# EAGLE design ethernet-wing-v1.00 (EAGLE 9.1.0)

## Sheet 1 of 2
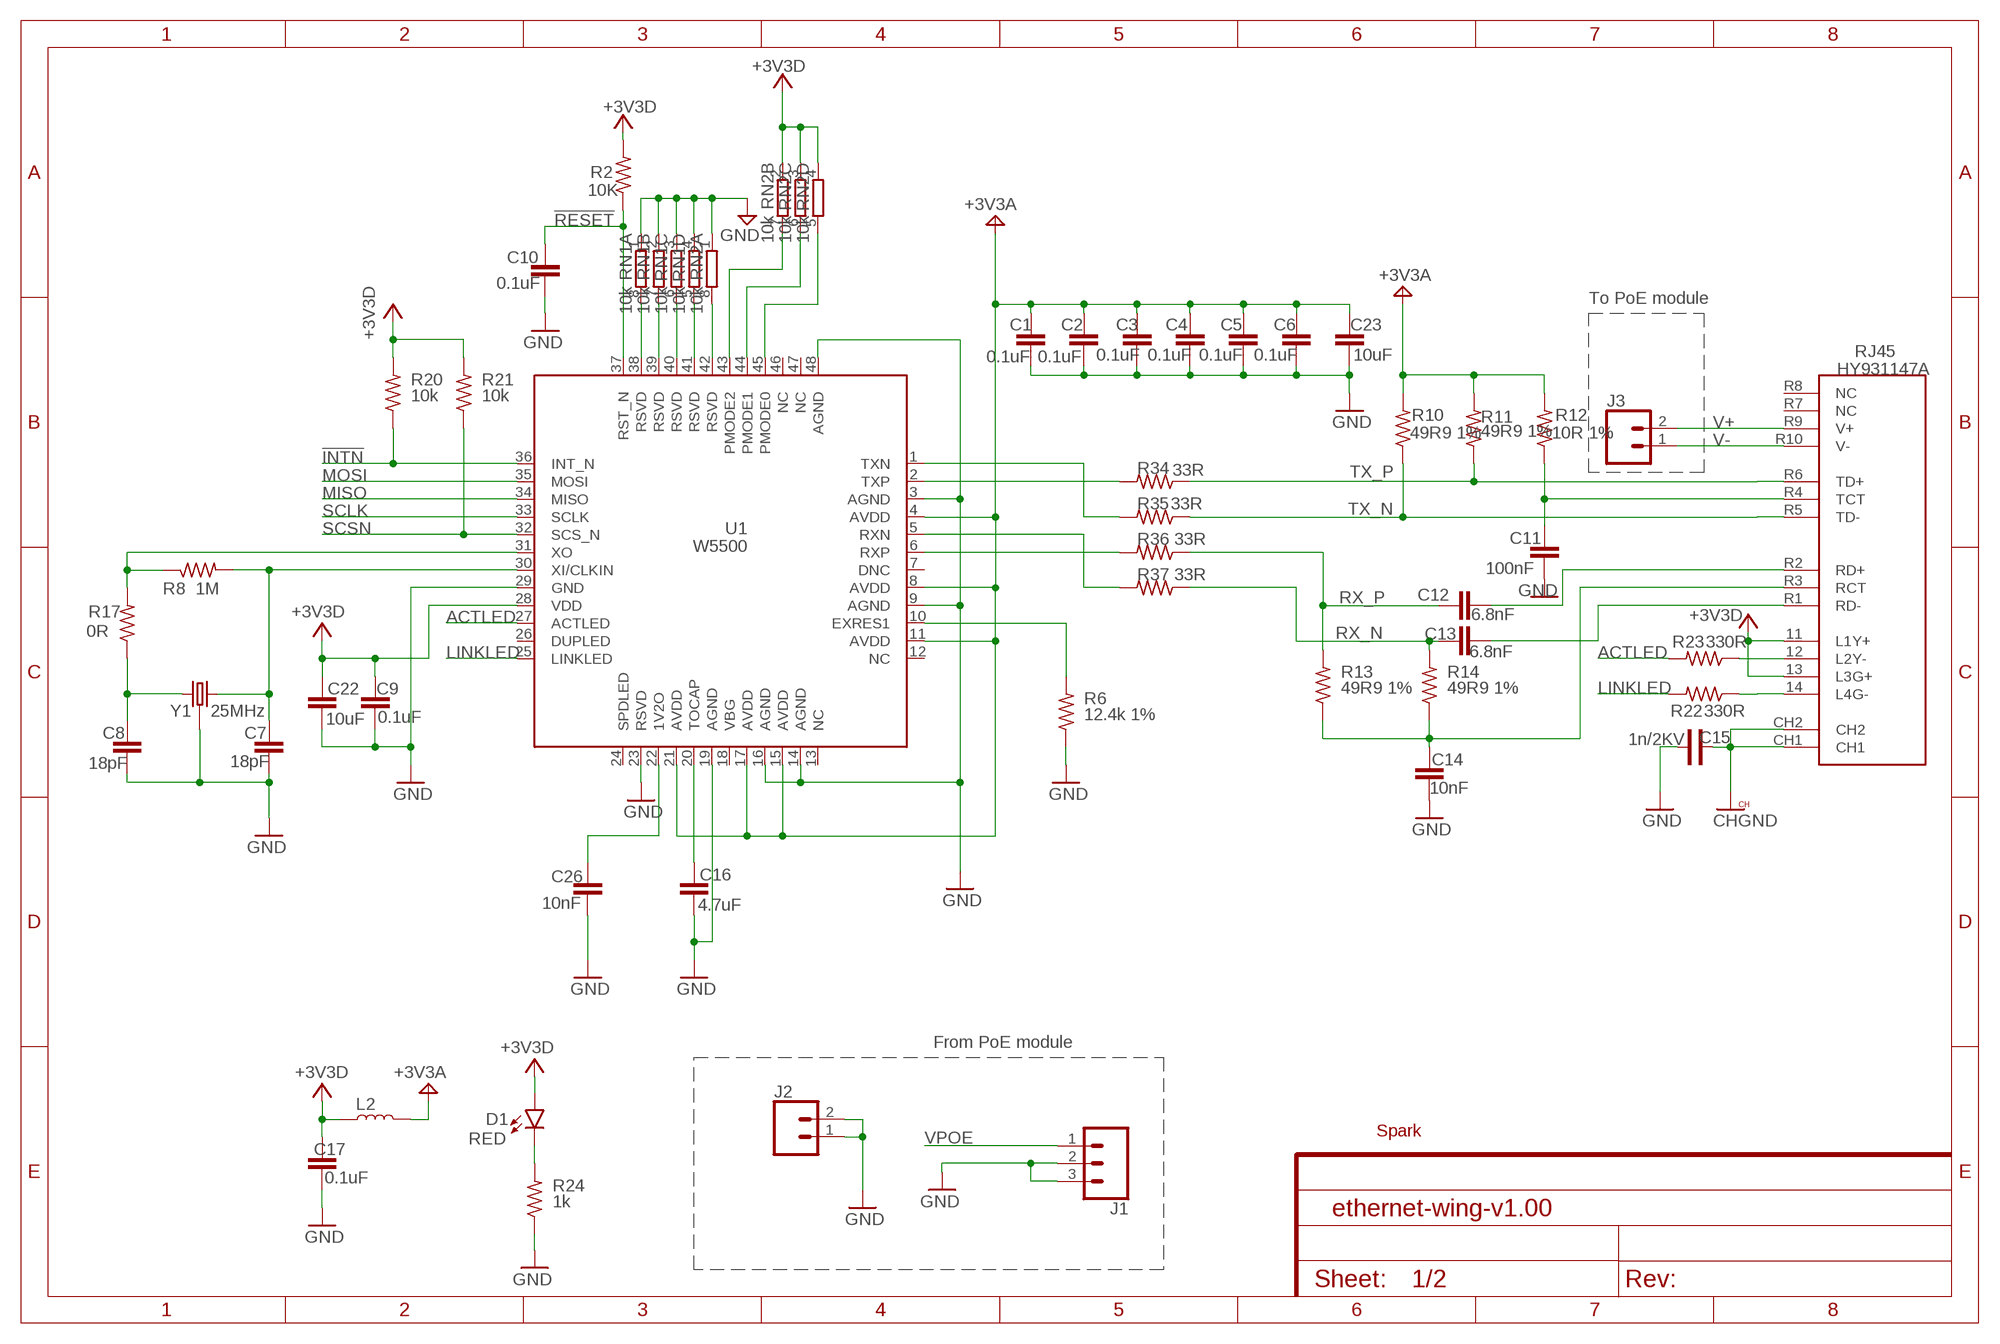
[diagram p0: schematic, sheet 1]

### Parts
C1  0.1uF  CAP_1  [C0402_B]
C2  0.1uF  CAP_1  [C0402_B]
C3  0.1uF  CAP_1  [C0402_B]
C4  0.1uF  CAP_1  [C0402_B]
C5  0.1uF  CAP_1  [C0402_B]
C6  0.1uF  CAP_1  [C0402_B]
C7  18pF  CAP_1  [C0402_B]
C8  18pF  CAP_1  [C0402_B]
C9  0.1uF  CAP_1  [C0402_B]
C10  0.1uF  CAP_1  [C0402_B]
C11  100nF  CAP_1  [C0402_B]
C12  6.8nF  CAP_1  [C0402_B]
C13  6.8nF  CAP_1  [C0402_B]
C14  10nF  CAP_1  [C0402_B]
C15  1n/2KV  C-1808  [C-1808]
C16  4.7uF  0.18UF-0603-10V-10%  [0603]
C17  0.1uF  CAP_1  [C0402_B]
C22  10uF  0.18UF-0603-10V-10%  [0603]
C23  10uF  0.18UF-0603-10V-10%  [0603]
C26  10nF  CAP_1  [C0402_B]
D1  RED  LED-RED0603  [LED-0603]
J1  CONN_03  [1X03]
J2  CONN_02  [1X02]
J3  CONN_02  [1X02]
L2  INDUCTOR-0805-3.3UH  [0805]
R2  10K  R-US_  [R0402_B]
R6  12.4k 1%  R-US_  [R0402_B]
R8  1M  R-US_  [R0402_B]
R10  49R9 1%  R-US_  [R0402_B]
R11  49R9 1%  R-US_  [R0402_B]
R12  10R 1%  R-US_  [R0402_B]
R13  49R9 1%  R-US_  [R0402_B]
R14  49R9 1%  R-US_  [R0402_B]
R17  0R  R-US_  [R0402_B]
R20  10k  R-US_  [R0402_B]
R21  10k  R-US_  [R0402_B]
R22  330R  R-US_  [R0402_B]
R23  330R  R-US_  [R0402_B]
R24  1k  R-US_  [R0402_B]
R34  33R  R-US_  [R0402_B]
R35  33R  R-US_  [R0402_B]
R36  33R  R-US_  [R0402_B]
R37  33R  R-US_  [R0402_B]
RJ45  HY931147A  ARDUINO-ETHERNET-SHIELD2-V2_POE_RJ45  [ARDUINO-ETHERNET-SHIELD2-V2_CONNETTORI_POE-RJ45]
RN1  10k  4R-N0402ARV341  [4X0402ARV341]
RN2  10k  4R-N0402ARV341  [4X0402ARV341]
U1  W5500  [W5500]
U$2  SPARK_LOGO2  [SPARK_LOGO2]
Y1  25MHz  CRYSTAL-GROUNDEDSMD-3.2X2.5  [CRYSTAL-SMD-3.2X2.5MM]

### Nets
!INTN: R20.1 U1.36(INT_N) ; also sheet 2
!RESET: C10.2 R2.1 U1.37(RST_N) ; also sheet 2
+3V3: C9.2 C17.2 C22.1 D1.A L2.1 R2.2 R20.2 R21.2 RJ45.11(L1Y+) RJ45.13(L3G+) RN2.2 RN2.3 RN2.4 U1.28(VDD) ; supply symbol labelled +3V3D ; also sheet 2
+3V3A: C1.2 C2.2 C3.2 C4.2 C5.2 C6.2 C23.1 L2.2 R10.2 R11.2 R12.2 U1.4(AVDD) U1.8(AVDD) U1.11(AVDD) U1.15(AVDD) U1.17(AVDD) U1.21(AVDD)
ACTLED: R23.2 U1.27(ACTLED)
CHGND: C15.P$1 RJ45.CH1 RJ45.CH2
GND: C1.1 C2.1 C3.1 C4.1 C5.1 C6.1 C7.1 C8.1 C9.1 C10.1 C11.1 C14.1 C15.P$2 C16.2 C17.1 C22.2 C23.2 C26.1 J1.2 J1.3 J2.1 J2.2 R6.1 R24.1 RN1.1 RN1.2 RN1.3 RN1.4 RN2.1 U1.3(AGND) U1.9(AGND) U1.14(AGND) U1.16(AGND) U1.19(AGND) U1.23(RSVD) U1.29(GND) U1.48(AGND) Y1.2 Y1.4 ; also sheet 2
LINKLED: R22.2 U1.25(LINKLED)
MISO: U1.34(MISO) ; also sheet 2
MOSI: U1.35(MOSI) ; also sheet 2
N$1: RN2.7 U1.43(PMODE2)
N$2: RN2.6 U1.44(PMODE1)
N$3: RN2.5 U1.45(PMODE0)
N$5: RN1.8 U1.38(RSVD)
N$6: RN1.7 U1.39(RSVD)
N$7: RN1.6 U1.40(RSVD)
N$8: RN1.5 U1.41(RSVD)
N$9: RN2.8 U1.42(RSVD)
N$11: C8.2 R17.1 Y1.1
N$12: C16.1 U1.20(TOCAP)
N$15: C26.2 U1.22(1V2O)
N$17: R6.2 U1.10(EXRES1)
N$19: C14.2 R13.1 R14.1 RJ45.R3(RCT)
N$20: D1.C R24.2
N$21: C11.2 R12.1 RJ45.R4(TCT)
N$22: R8.1 R17.2 U1.31(XO)
N$29: C7.2 R8.2 U1.30(XI/CLKIN) Y1.3
N$37: R23.1 RJ45.12(L2Y-)
N$87: R22.1 RJ45.14(L4G-)
R_N: R37.2 U1.5(RXN)
R_P: R36.2 U1.6(RXP)
RR_N: C13.2 RJ45.R1(RD-)
RR_P: C12.2 RJ45.R2(RD+)
RX_N: C13.1 R14.2 R37.1
RX_P: C12.1 R13.2 R36.1
SCLK: U1.33(SCLK) ; also sheet 2
SCSN: R21.1 U1.32(SCS_N) ; also sheet 2
T_N: R35.2 U1.1(TXN)
T_P: R34.2 U1.2(TXP)
TX_N: R10.1 R35.1 RJ45.R5(TD-)
TX_P: R11.1 R34.1 RJ45.R6(TD+)
V+: J3.2 RJ45.R9(V+)
V-: J3.1 RJ45.R10(V-)
VPOE: J1.1 ; also sheet 2
Unconnected: RJ45.R7(NC) RJ45.R8(NC) U1.7(DNC) U1.12(NC) U1.13(NC) U1.18(VBG) U1.24(SPDLED) U1.26(DUPLED) U1.46(NC) U1.47(NC)

### Notes on the sheet
- To PoE module
- From PoE module

## Sheet 2 of 2
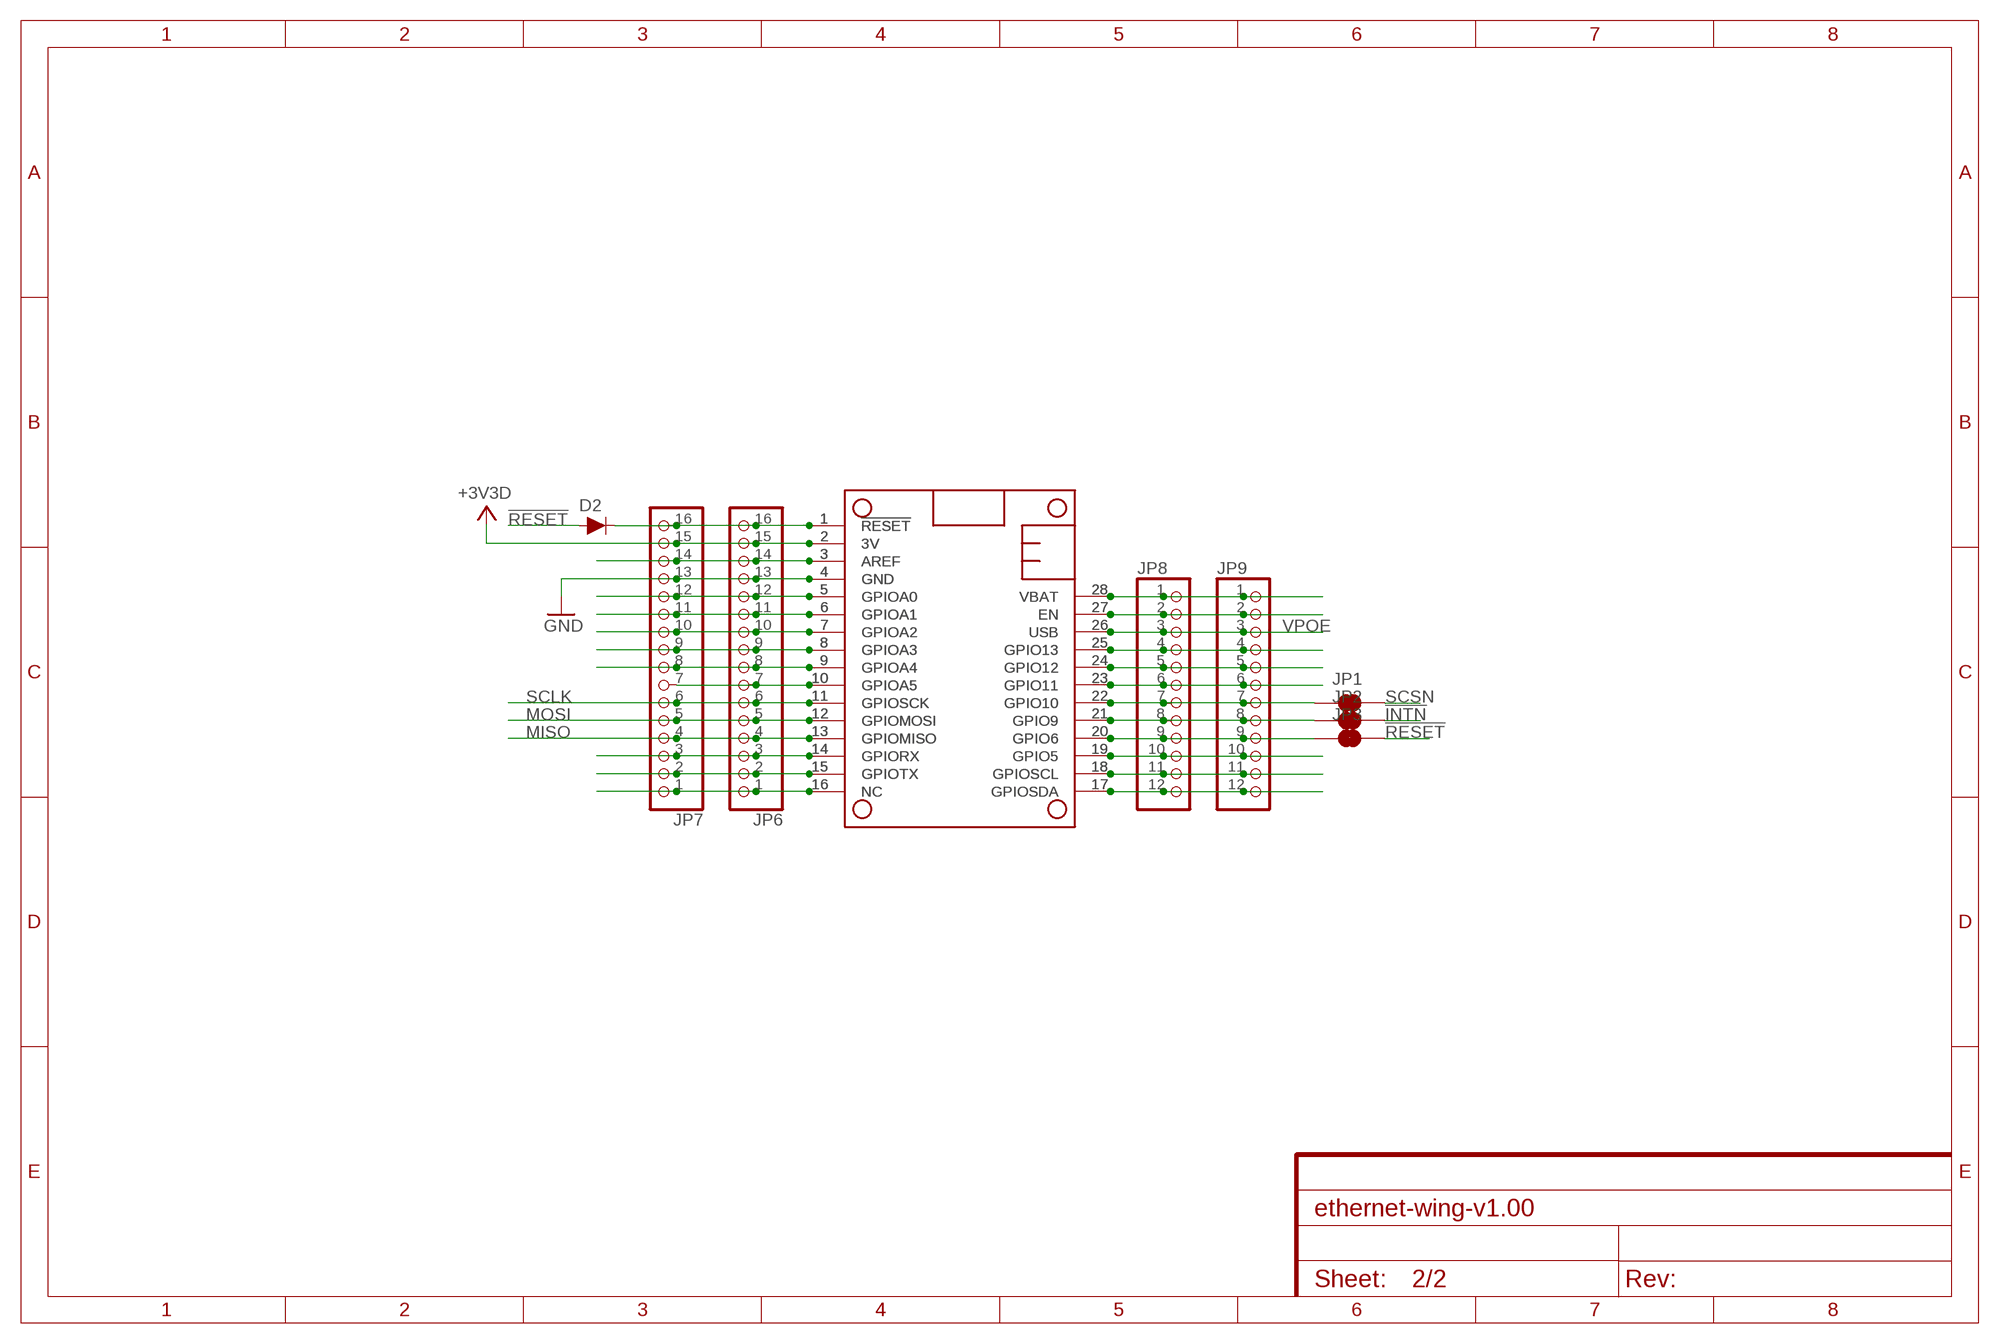
[diagram p1: schematic, sheet 2]

### Parts
D2  DIODE-BAS16J  [SOD-323]
JP1  JUMPER-SMT_2_NC_TRACE_NO-SILK  [SMT-JUMPER_2_NC_TRACE_NO-SILK]
JP2  JUMPER-SMT_2_NC_TRACE_NO-SILK  [SMT-JUMPER_2_NC_TRACE_NO-SILK]
JP3  JUMPER-SMT_2_NC_TRACE_NO-SILK  [SMT-JUMPER_2_NC_TRACE_NO-SILK]
JP6  MICROBUILDER_HEADER-1X16_76MIL  [MICROBUILDER_1X16_ROUND_76MIL]
JP7  MICROBUILDER_HEADER-1X16_76MIL  [MICROBUILDER_1X16_ROUND_76MIL]
JP8  MICROBUILDER_HEADER-1X1276MIL  [MICROBUILDER_1X12_ROUND_76MIL]
JP9  MICROBUILDER_HEADER-1X1276MIL  [MICROBUILDER_1X12_ROUND_76MIL]
MS1  MICROBUILDER_FEATHERWING_NODIM  [MICROBUILDER_FEATHERWING_DIM]
MS2  MICROBUILDER_FEATHERWING_NODIM  [MICROBUILDER_FEATHERWING_DIM]

### Nets
!INTN: JP2.2 ; also sheet 1
!RESET: D2.A JP3.2 ; also sheet 1
!RESET!!: D2.C JP6.16 JP7.16 MS1.1(!RESET) MS2.1(!RESET)
+3V3: JP6.15 JP7.15 MS1.2(3V) MS2.2(3V) ; supply symbol labelled +3V3D ; also sheet 1
GND: JP6.13 JP7.13 MS1.4(GND) MS2.4(GND) ; also sheet 1
MISO: JP6.4 JP7.4 MS1.13(GPIOMISO) MS2.13(GPIOMISO) ; also sheet 1
MOSI: JP6.5 JP7.5 MS1.12(GPIOMOSI) MS2.12(GPIOMOSI) ; also sheet 1
N$16: JP6.14 JP7.14 MS1.3(AREF) MS2.3(AREF)
N$18: JP8.2 JP9.2 MS1.27(EN) MS2.27(EN)
N$23: JP8.10 JP9.10 MS1.19(GPIO5) MS2.19(GPIO5)
N$24: JP3.1 JP8.9 JP9.9 MS1.20(GPIO6) MS2.20(GPIO6)
N$25: JP2.1 JP8.8 JP9.8 MS1.21(GPIO9) MS2.21(GPIO9)
N$26: JP1.1 JP8.7 JP9.7 MS1.22(GPIO10) MS2.22(GPIO10)
N$27: JP8.6 JP9.6 MS1.23(GPIO11) MS2.23(GPIO11)
N$28: JP8.5 JP9.5 MS1.24(GPIO12) MS2.24(GPIO12)
N$30: JP8.4 JP9.4 MS1.25(GPIO13) MS2.25(GPIO13)
N$31: JP6.12 JP7.12 MS1.5(GPIOA0) MS2.5(GPIOA0)
N$32: JP6.11 JP7.11 MS1.6(GPIOA1) MS2.6(GPIOA1)
N$33: JP6.10 JP7.10 MS1.7(GPIOA2) MS2.7(GPIOA2)
N$34: JP6.9 JP7.9 MS1.8(GPIOA3) MS2.8(GPIOA3)
N$35: JP6.8 JP7.8 MS1.9(GPIOA4) MS2.9(GPIOA4)
N$36: JP6.7 JP7.7 MS1.10(GPIOA5) MS2.10(GPIOA5)
N$39: JP6.3 JP7.3 MS1.14(GPIORX) MS2.14(GPIORX)
N$41: JP8.11 JP9.11 MS1.18(GPIOSCL) MS2.18(GPIOSCL)
N$42: JP8.12 JP9.12 MS1.17(GPIOSDA) MS2.17(GPIOSDA)
N$43: JP6.2 JP7.2 MS1.15(GPIOTX) MS2.15(GPIOTX)
N$44: JP6.1 JP7.1 MS1.16(NC) MS2.16(NC)
SCLK: JP6.6 JP7.6 MS1.11(GPIOSCK) MS2.11(GPIOSCK) ; also sheet 1
SCSN: JP1.2 ; also sheet 1
VBAT: JP8.1 JP9.1 MS1.28(VBAT) MS2.28(VBAT)
VPOE: JP8.3 JP9.3 MS1.26(USB) MS2.26(USB) ; also sheet 1

## Library data of the parts
C1-C14 C17 C26 = Particle:CAP_1
C15 = CAP:C-1808
C16 C22 C23 = SparkFun-Capacitors:0.18UF: 0.18µF ceramic capacitor A capacitor is a passive two-terminal electrical component used to store electrical energy temporarily in an electric field.; PROD_ID: CAP-12380; VALUE: 0.18uF
D1 = SparkFun-LED:LED-RED: Red SMD LED Used in manufacturing of most products at SparkFun Packages: 0603 - SMD 0603 package [Product Link] <http://docs.avagotech.com/docs/AV02-0551EN> 0603 SMART - SMD 0603 SMART package ( more efficient and expensive)[Product Link] <http://www.osram-os.com/Graphics/XPic2/00077099_0.pdf> 1206 - SMD1206 package [Product Link] <https://www.sparkfun.com/datasheets/DevTools/LilyPad/Q150OVS4.pdff> SparkFun Products: Pro Mini 328 -5V <https://www.sparkfun.com/products/821> RedBoard <https://www.sparkfun.com/products/12757> IOIO-OTG <https://www.sparkfun.com/products/13613>; PROD_ID: DIO-00819
D2 = SparkFun-DiscreteSemi:DIODE: Diode These are standard reverse protection diodes and small signal diodes. SparkFun Products: SparkFun SparkPunk Sound Kit <https://www.sparkfun.com/products/11177> SparkFun ESP8266 Thing <https://www.sparkfun.com/products/13231>; PROD_ID: DIO-09646; VALUE: 250mA/100V
J1 = SparkFun-Connectors:CONN_03: Multi connection point. Often used as Generic Header-pin footprint for 0.1 inch spaced/style header connections On any of the 0.1 inch spaced packages, you can populate with these: Break Away Headers - Straight <https://www.sparkfun.com/products/116> (PRT-00116) Break Away Male Headers - Right Angle <https://www.sparkfun.com/products/553> (PRT-00553) Female Headers <https://www.sparkfun.com/products/115> (PRT-00115) Break Away Headers - Machine Pin <https://www.sparkfun.com/products/117> (PRT-00117) Break Away Female Headers - Swiss Machine Pin <https://www.sparkfun.com/products/743> (PRT-00743) Stackable Header - 3 Pin (Female, 0.1") <https://www.sparkfun.com/products/13875> (PRT-13875) For SCREWTERMINALS and SPRING TERMINALS visit here: Screw Terimnals on SparkFun.com <https://www.sparkfun.com/search/results?term=Screw+Terminals> (5mm/3.5mm/2.54mm spacing) This device is also useful as a general connection point to wire up your design to another part of your project. Our various solder wires solder well into these plated through hole pads. Hook-Up Wire - Assortment (Stranded, 22 AWG) <https://www.sparkfun.com/products/11375> (PRT-11375) Hook-Up Wire - Assortment (Solid Core, 22 AWG) <https://www.sparkfun.com/products/11367> (PRT-11367) View the entire wire category on our website here <https://www.sparkfun.com/categories/141> Special notes: Molex polarized connector foot print use with SKU : PRT-08232 with associated crimp pins and housings.
J2 J3 = SparkFun-Connectors:CONN_02: Multi connection point. Often used as Generic Header-pin footprint for 0.1 inch spaced/style header connections On any of the 0.1 inch spaced packages, you can populate with these: Break Away Headers - Straight <https://www.sparkfun.com/products/116> (PRT-00116) Break Away Male Headers - Right Angle <https://www.sparkfun.com/products/553> (PRT-00553) Female Headers <https://www.sparkfun.com/products/115> (PRT-00115) Break Away Headers - Machine Pin <https://www.sparkfun.com/products/117> (PRT-00117) Break Away Female Headers - Swiss Machine Pin <https://www.sparkfun.com/products/743> (PRT-00743) For SCREWTERMINALS and SPRING TERMINALS visit here: Screw Terimnals on SparkFun.com <https://www.sparkfun.com/search/results?term=Screw+Terminals> (5mm/3.5mm/2.54mm spacing) This device is also useful as a general connection point to wire up your design to another part of your project. Our various solder wires solder well into these plated through hole pads. Hook-Up Wire - Assortment (Stranded, 22 AWG) <https://www.sparkfun.com/products/11375> (PRT-11375) Hook-Up Wire - Assortment (Solid Core, 22 AWG) <https://www.sparkfun.com/products/11367> (PRT-11367) View the entire wire category on our website here <https://www.sparkfun.com/categories/141> Special notes: Molex polarized connector foot print use with: PRT-08233 with associated crimp pins and housings. 2.54_SCREWTERM for use with PRT-10571. 3.5mm Screw Terminal footprints for PRT-08084 5mm Screw Terminal footprints for use with PRT-08432
JP1-JP3 = SparkFun-Jumpers:JUMPER-SMT_2_NC_TRACE: Normally closed trace jumper This jumper has a trace between two pads so it's normally closed (NC). Use a razor knife to open the connection. For best results follow the IPC guidelines for cutting traces: Cutout at least 0.063 mm (0.005 in). Remove all loose material to clean up the cut area. Seal the cut with an approved epoxy. Reapply solder to reclose the connection.
JP6 JP7 = DoubleWing:MICROBUILDER_HEADER-1X16: PIN HEADER
JP8 JP9 = DoubleWing:MICROBUILDER_HEADER-1X12
L2 = SparkFun-Coils:INDUCTOR: Inductors Resist changes in electrical current. Basically a coil of wire. SparkFun Products: SparkFun Load Cell Amplifier - HX711 <https://www.sparkfun.com/products/13879> IOIO-OTG - V2.2 <https://www.sparkfun.com/products/13613>; PROD_ID: NDUC-13076; VALUE: 3.3µH/±20%/450mA
MS1 MS2 = DoubleWing:MICROBUILDER_FEATHERWING
R2 R6 R8 R10-R14 R17 R20-R24 R34-R37 = Particle:R-US_: 0402 Resistor
RJ45 = L12.0:ARDUINO-ETHERNET-SHIELD2-V2_POE_RJ45
RN1 RN2 = resistor-dil:4R-N: Array Chip Resistor Source: RS Component / Phycomp; OC_FARNELL: unknown; OC_NEWARK: unknown
U1 = W5500_Ethernet_shield_v10:W5500
U$2 = Particle:SPARK_LOGO2
Y1 = SparkFun-Clocks:CRYSTAL-GROUNDED: Crystals w/ Ground Pin (Generic) These are passive quartz crystals, which can be used as a clock source for a microcontroller. Crystal's are usually two-terminal devices. A third terminal may be optionally connected to ground, as recommended by the manufaturer.

## Board
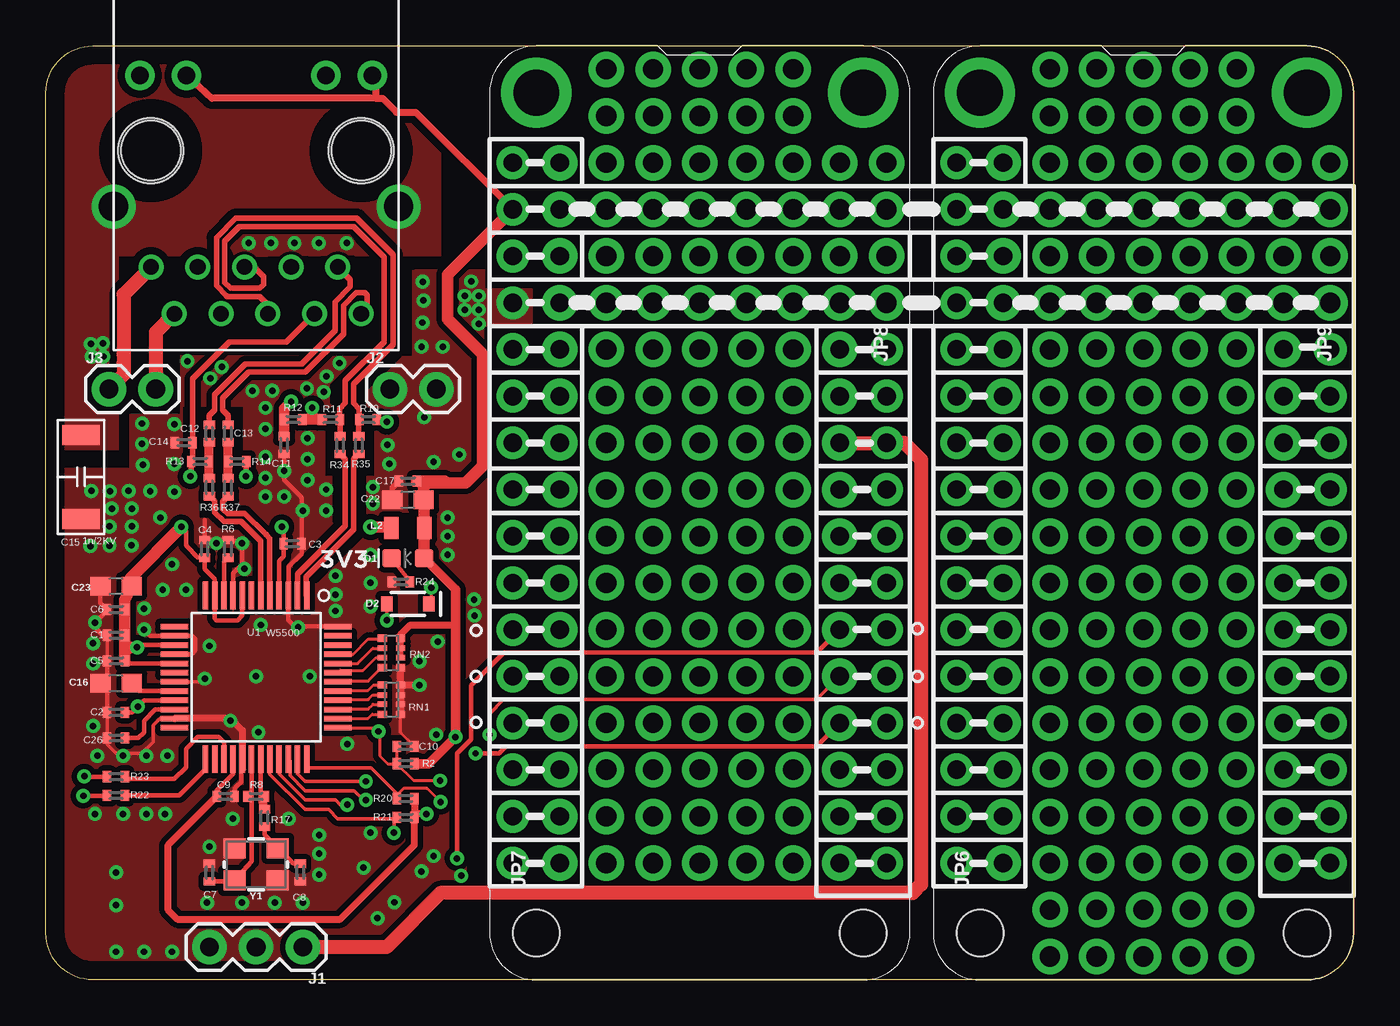
[diagram p2: board, top side]
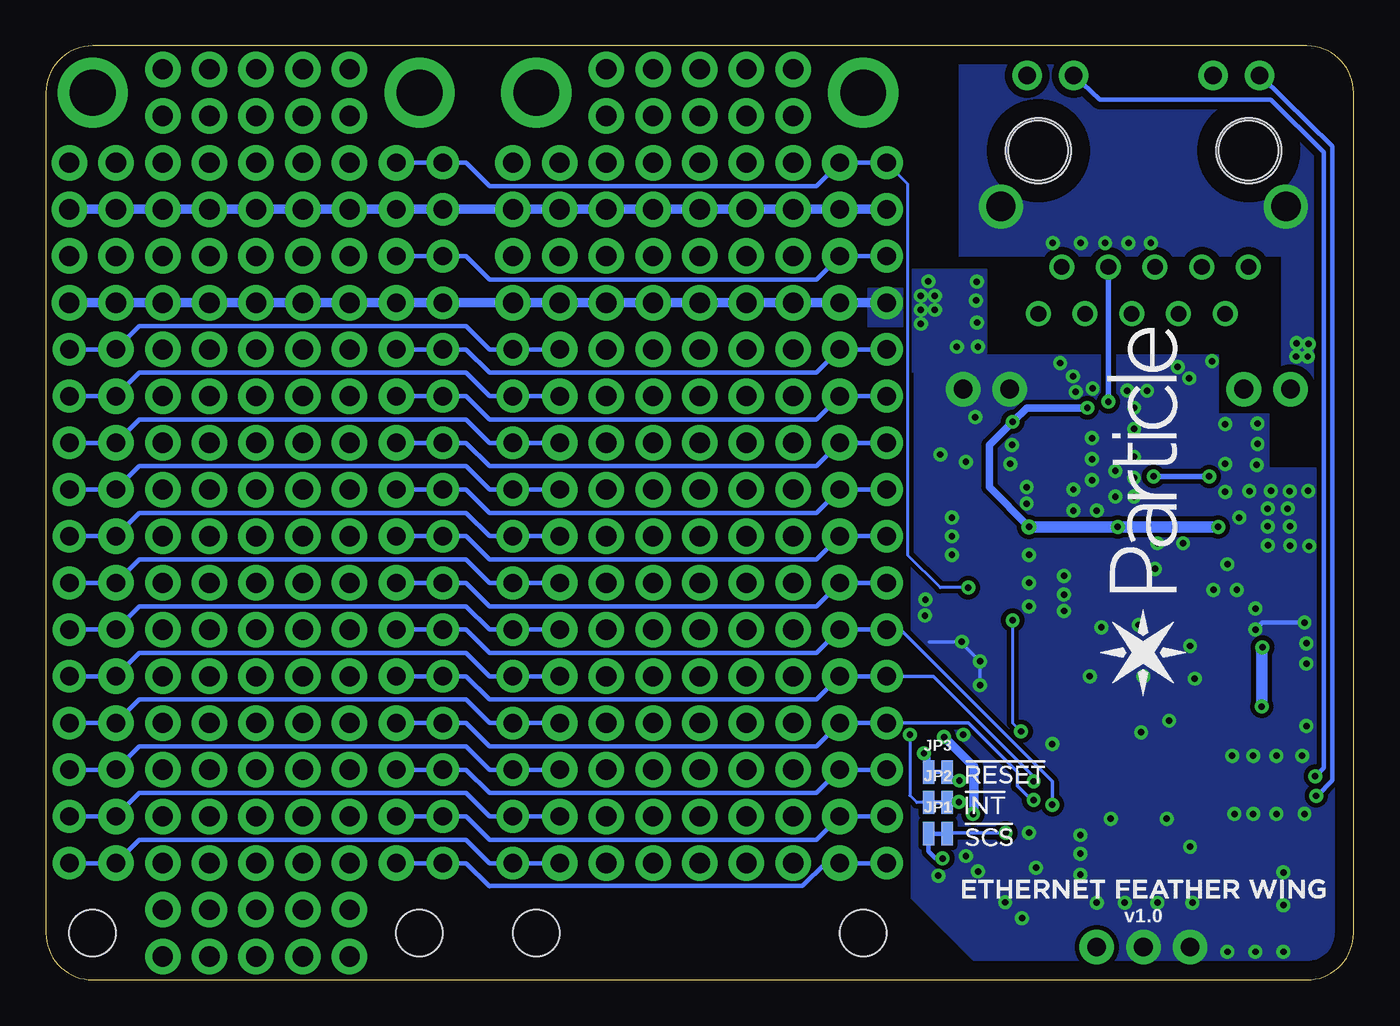
[diagram p3: board, bottom side, seen from below]

Size 71.12 x 50.8 mm. Coordinates in mm from the lower left corner, seen from the top.
Outline: 68.58,0 2.54,0 arc-90 0,2.54 0,48.26 arc-90 2.54,50.8 68.58,50.8 arc-90 71.12,48.26 71.12,2.54 arc-90 68.58,0
Copper layers (1*16): Top 0.035mm / dielectric 1.5mm / Bottom 0.035mm
Design rules "default *": minimum track width 6mil, minimum drill 0.35mm, track to track 6mil, track to pad 6mil, pad to pad 6mil, via to via 6mil, smd to smd 6mil, copper to edge 40mil, drill to drill 6mil, minimum pad ring 10mil, minimum via ring 8mil, stop-mask expansion 4mil, vias tented up to drill 0.35mm, thermal gap 10mil
Holes 3.56 mm at 5.69,45.11 17.14,45.11

### Footprints (pad centres in the part's own frame; a part is rotated, then mirrored left to right if it is on the bottom)
C0402_B = smd 0.457 x 0.61: 1 -0.483,0; 2 0.483,0
C-1808 = smd 1.1 x 2.05: P$1 -2.285,0; P$2 2.285,0
0603 = smd 1.1 x 1: 1 -0.85,0; 2 0.85,0
LED-0603 = smd 1 x 1: A -0.877,0; C 0.877,0
SOD-323 = smd 0.63 x 0.83: A 1.15,0; C -1.15,0
1X03 = drill 1.016 pad 1.88: 1 0,0; 2 2.54,0; 3 5.08,0
1X02 = drill 1.016 pad 1.88: 1 0,0; 2 2.54,0
SMT-JUMPER_2_NC_TRACE_NO-SILK = smd 0.635 x 1.27: 1 -0.508,0; 2 0.508,0
MICROBUILDER_1X16_ROUND_76MIL = drill 1 pad 1.93: 1 -19.05,0; 2 -16.51,0; 3 -13.97,0; 4 -11.43,0; 5 -8.89,0; 6 -6.35,0; 7 -3.81,0; 8 -1.27,0; 9 1.27,0; 10 3.81,0; 11 6.35,0; 12 8.89,0; 13 11.43,0; 14 13.97,0; 15 16.51,0; 16 19.05,0
MICROBUILDER_1X12_ROUND_76MIL = drill 1 pad 1.93: 1 -13.97,0; 2 -11.43,0; 3 -8.89,0; 4 -6.35,0; 5 -3.81,0; 6 -1.27,0; 7 1.27,0; 8 3.81,0; 9 6.35,0; 10 8.89,0; 11 11.43,0; 12 13.97,0
0805 = smd 0.8 x 1.2: 1 -0.9,0; 2 0.9,0
MICROBUILDER_FEATHERWING_DIM = drill 1 pad 1.778: 1 6.35,1.27; 2 8.89,1.27; 3 11.43,1.27; 4 13.97,1.27; 5 16.51,1.27; 6 19.05,1.27; 7 21.59,1.27; 8 24.13,1.27; 9 26.67,1.27; 10 29.21,1.27; 11 31.75,1.27; 12 34.29,1.27; 13 36.83,1.27; 14 39.37,1.27; 15 41.91,1.27; 16 44.45,1.27; 17 44.45,21.59; 18 41.91,21.59; 19 39.37,21.59; 20 36.83,21.59; 21 34.29,21.59; 22 31.75,21.59; 23 29.21,21.59; 24 26.67,21.59; 25 24.13,21.59; 26 21.59,21.59; 27 19.05,21.59; 28 16.51,21.59 | drill 2.5 pad 3.81: P$1 2.54,20.32; P$2 2.54,2.54 | hole 2.54: 48.26,20.32; 48.26,2.54
R0402_B = smd 0.457 x 0.61: 1 -0.483,0; 2 0.483,0
ARDUINO-ETHERNET-SHIELD2-V2_CONNETTORI_POE-RJ45 = drill 0.95 pad 1.6: 11 6.81,6.325; 12 6.81,3.785; 13 6.81,-3.785; 14 6.81,-6.325 | drill 1.6: CH1 13.94,7.75; CH2 13.94,-7.75 | drill 0.85 pad 1.3: R1 19.77,5.715; R2 17.23,4.445; R3 19.77,3.175; R4 17.23,1.905; R5 19.77,0.635; R6 17.23,-0.635; R7 19.77,-1.905; R8 17.23,-3.175; R9 19.77,-4.445; R10 17.23,-5.715 | hole 3.25: 10.89,5.715; 10.89,-5.715
4X0402ARV341 = smd 0.4 x 0.5: 1 -0.8,-0.5; 4 0.8,-0.5; 5 0.8,0.5; 8 -0.8,0.5 | smd 0.3 x 0.5: 2 -0.25,-0.5; 3 0.25,-0.5; 6 0.25,0.5; 7 -0.25,0.5
W5500 = smd 1.5 x 0.3: 1 -4.45,2.75; 2 -4.45,2.25; 3 -4.45,1.75; 4 -4.45,1.25; 5 -4.45,0.75; 6 -4.45,0.25; 7 -4.45,-0.25; 8 -4.45,-0.75; 9 -4.45,-1.25; 10 -4.45,-1.75; 11 -4.45,-2.25; 12 -4.45,-2.75; 25 4.45,-2.75; 26 4.45,-2.25; 27 4.45,-1.75; 28 4.45,-1.25; 29 4.45,-0.75; 30 4.45,-0.25; 31 4.45,0.25; 32 4.45,0.75; 33 4.45,1.25; 34 4.45,1.75; 35 4.45,2.25; 36 4.45,2.75 | smd 0.3 x 1.5: 13 -2.75,-4.45; 14 -2.25,-4.45; 15 -1.75,-4.45; 16 -1.25,-4.45; 17 -0.75,-4.45; 18 -0.25,-4.45; 19 0.25,-4.45; 20 0.75,-4.45; 21 1.25,-4.45; 22 1.75,-4.45; 23 2.25,-4.45; 24 2.75,-4.45; 37 2.75,4.45; 38 2.25,4.45; 39 1.75,4.45; 40 1.25,4.45; 41 0.75,4.45; 42 0.25,4.45; 43 -0.25,4.45; 44 -0.75,4.45; 45 -1.25,4.45; 46 -1.75,4.45; 47 -2.25,4.45; 48 -2.75,4.45
CRYSTAL-SMD-3.2X2.5MM = smd 1.2 x 1.1: 1 -1.175,-0.875; 2 1.175,-0.875; 3 1.175,0.875; 4 -1.175,0.875

### Placement (x,y rotation side)
C1  3.81,18.75 0 top
C2  3.81,14.55 0 top
C3  13.41,23.72 180 top
C4  8.64,23.44 270 top
C5  3.81,17.35 0 top
C6  3.81,20.14 0 top
C7  8.89,5.84 270 top
C8  13.84,5.84 90 top
C9  9.78,9.98 180 top
C10  19.56,12.7 180 top
C11  12.95,29.08 90 top
C12  8.89,29.72 90 top
C13  9.91,29.72 90 top
C14  7.49,29.21 0 top
C15  1.91,27.36 270 top
C16  3.81,16.13 180 top
C17  19.68,27.13 0 top
C22  19.68,26.11 180 top
C23  3.81,21.41 180 top
C26  3.81,13.16 0 top
D1  19.68,22.94 180 top
D2  19.68,20.45 180 top
J1  13.97,1.78 180 top
J2  18.7,32.13 0 top
J3  3.43,32.13 0 top
JP1  22.61,7.95 0 bottom
JP2  22.61,9.65 0 bottom
JP3  22.61,11.3 0 bottom
JP6  52.07,25.4 90 top
JP7  27.94,25.4 90 top
JP8  43.18,20.32 270 top
JP9  67.31,20.32 270 top
L2  19.68,24.59 180 top
MS1  48.26,50.8 270 top
MS2  24.13,50.8 270 top
R2  19.56,11.76 0 top
R6  9.91,23.44 270 top
R8  11.43,9.98 180 top
R10  17.53,30.48 0 top
R11  15.49,30.48 180 top
R12  13.46,30.48 0 top
R13  8.38,28.19 0 top
R14  10.41,28.19 180 top
R17  11.89,8.81 90 top
R20  19.56,9.86 0 top
R21  19.56,8.84 0 top
R22  3.81,10.03 0 top
R23  3.81,11.05 0 top
R24  19.3,21.64 0 top
R34  16,29.08 270 top
R35  17.02,29.08 270 top
R36  8.89,26.8 270 top
R37  9.91,26.8 270 top
RJ45  11.43,56.01 270 top
RN1  18.8,15.24 90 top
RN2  18.8,17.78 90 top
U1  11.43,16.46 270 top
U$2  1.27,1.27 0 top
Y1  11.43,6.28 180 top

### Tracks (layer width: path | path; a pad name or v marks a point on that pad's centre or on a via)
!INTN  (via drill 0.35)
  Top 0.152: 19.07,10.03 19.46,10.41 20.72,10.41 v21.46,9.68
  Top 0.203: R20.1 19.07,10.03 19.07,10.13 17.68,11.53 14.18,11.53 U1.36
  Bottom 0.152: JP2.2 22.07,9.68 v21.46,9.68
  Bottom 0.203: 21.97,10.16 JP2.2 22.1,10.18
!RESET  (via drill 0.35)
  Top 0.152: U1.37 17.89,13.71 v18.09,13.51 18.16,13.44 18.16,12.19 18.59,11.76 R2.1 | D2.A 18.54,19.44 18.54,19.43 v18.54,19.56 | C10.2 R2.1 | R2.1 20,10.84 v21.44,10.84
  Bottom 0.152: v18.54,19.56 18.54,13.97 v18.09,13.51 | JP3.2 21.63,10.84 v21.44,10.84
!RESET!!  (via drill 0.35)
  Top 0.152: v20.95,21.34 20.95,20.57 D2.C
  Top 0.254: D2.C 20.7,20.58
  Bottom 0.152: v20.95,21.34 22.48,21.34 24.26,23.11 24.26,43.31 MS2.1
  Bottom 0.254: JP6.16 MS1.1 48.26,44.45 46.99,43.18 29.21,43.18 JP7.16 MS2.1
+3V3  (via drill 0.35, 1.1 pad 1.93)
  Top 0.203: 20.04,9.14 R21.2
  Top 0.254: U1.28 10.18,11.2 9.3,10.31 C9.2
  Top 0.3: RN2.2 RN2.3 | RN2.4 19.3,18.54
  Top 0.381: C22.1 20.54,24.64 L2.1 20.59,22.96 D1.A 20.83,22.67 | MS2.2 20.11,47.2 19.07,47.2 18.32,47.95 17.93,47.95 | 20.04,9.14 20.04,7.34 16,3.3 7.14,3.3 6.63,3.81 6.63,7.32 C9.2 | R20.2 20.04,9.14 | 20.83,9.02 v20.7,9.02 20.17,9.02 20.04,9.14 | RJ45.13 9.01,47.95 17.93,47.95 | RJ45.11 17.93,49.14 17.93,47.95 | RN2.3 19.3,18.54 19.3,18.79 19.81,19.3 22.14,19.3 22.27,19.43
  Top 0.508: D1.A 22.27,21.23 22.27,19.43 v22.27,13.21 20.82,11.76 R2.2
  Top 0.635: D1.A 20.56,26.08 C22.1 20.54,27.01 | 21.69,27.13 C17.2 20.54,27.01 | 20.54,27.01 22.82,27.01 23.75,27.94 23.75,34.04 21.84,35.94 21.84,38.35 MS2.2
  Bottom 0.203: MS1.2 52.32,41.91 | JP6.15 54.23,41.91 | v57.15,41.91 60.2,41.91 | v59.69,41.91 62.48,41.91 | v62.23,41.91 65.41,41.91 | v64.77,41.91 67.18,41.91 | JP7.15 MS2.2 | 28.07,41.91 v30.48,41.91 33.15,41.91 | v33.02,41.91 35.69,41.91 | v35.56,41.91 38.35,41.91 | v38.1,41.91 41.15,41.91 | v40.64,41.91 43.43,41.91 | v43.18,41.91 v45.72,41.91 45.97,41.91
  Bottom 0.254: v67.31,41.91 67.18,41.91
  Bottom 0.508: v69.85,41.91 67.18,41.91 65.41,41.91 62.48,41.91 60.2,41.91 v54.61,41.91 54.23,41.91 52.32,41.91 45.97,41.91 43.43,41.91 41.15,41.91 38.35,41.91 35.69,41.91 33.15,41.91 28.07,41.91 MS2.2 | v20.7,9.02 20.65,9.06 20.65,11.59 v22.27,13.21
+3V3A  (via drill 0.35, 0.35 pad 0.8)
  Top 0.254: U1.17 4.43,17.21 C5.2 | 4.83,18.21 U1.15 | 4.29,17.78 4.37,18.21 4.83,18.21 | U1.4 12.68,22.79 12.93,23.04 C3.2 12.93,24.61 12.95,24.64 v12.83,24.64 | U1.8 10.68,19.82 10.41,19.56 9.27,19.56 9.18,19.65 U1.11 9.18,21.81 8.64,22.35 C4.2 8.61,22.99 8.26,22.99 7.62,23.62 7.62,24.38 v7.37,24.64 | 4.83,18.21 v4.95,18.09 | U1.21 5.33,15.21 v4.99,14.87 4.68,14.55 C2.2
  Top 0.3: R10.2 18.14,30.35 v18.54,30.35
  Top 0.381: 4.29,20.66 C6.2 C1.2 4.29,17.78
  Top 0.559: 14.48,30.48 R12.2 | 14.48,30.48 R11.2 | v14.48,31.11 14.48,30.48
  Top 0.635: L2.2 18.73,24.64 v17.65,24.64 | C5.2 4.29,17.78 | 4.29,17.78 4.29,20.66 C23.1 4.57,21.45 4.57,21.84 v7.37,24.64 | v4.95,18.09 4.49,18.09 4.29,17.78
  Bottom 0.4: v17.65,24.64 19.81,26.8 19.81,29.08 v18.54,30.35 17.78,31.11 v14.48,31.11
  Bottom 0.635: v17.65,24.64 v12.83,24.64 v7.37,24.64 | v4.99,14.87 4.99,18.05 v4.95,18.09
ACTLED
  Top 0.254: U1.27 9.68,12.93 9.4,13.21 8.26,13.21 7.62,12.57 7.62,11.56 6.99,10.92 4.42,10.92 R23.2
CHGND  (via drill 0.35)
  other vias: 11.02,40.08 12.24,40.08 13.51,40.08 14.83,40.08 16.36,40.08 3.1,34.63 2.49,33.9 2.44,34.59 3.12,33.9
  pour Bottom (isolate 0.4, no thermals): 2.41,50.8 21.46,50.8 21.46,39.37 3.94,39.37 3.94,28.83 0,28.83 0,48.39
  pour Top (isolate 0.4, no thermals): 2.41,50.8 21.46,50.8 21.46,39.37 3.94,39.37 3.94,28.83 0,28.83 0,48.39
  pour Top: 10.72,40.54 16.51,40.54 17.32,39.42 10.31,39.32 10.06,39.83 10.16,39.98
GND  (via drill 0.35, 0.35 pad 0.4, 0.35 pad 0.6, 1.1 pad 1.93)
  Top 0.152: C10.1 19.3,13.45 RN1.1
  Top 0.203: 3.33,14.73 C2.1 C26.1 3.33,12.8 3.81,12.32 5.21,12.32 5.84,12.95 5.84,13.84 6.21,14.21 U1.23 | C1.1 3.33,17.14 | C5.1 3.33,16 | U1.19 8.46,16.21 v8.64,16.38
  Top 0.254: 3.33,14.73 3.33,16 3.33,17.14 | v5.33,19.05 5.67,18.71 U1.14 7.96,18.71 8.13,18.54 8.13,17.91 8,17.78 7.82,17.71 U1.16 | C1.1 3.1,18.75 2.67,19.18 v2.67,19.43 3.33,20.09 C6.1 2.96,20.51 C23.2 | 10.68,11.43 U1.29 10.61,11.94 10.61,10.76 10.26,10.41 C9.1 | C11.1 12.95,27.18 13.89,26.24 C3.1 13.89,23.16 13.21,22.48 13.21,20.94 U1.3 13.18,19.59 13.56,19.21 U1.48 | 8.64,25.02 C4.1 R6.1 9.96,23.88 10.41,23.88 10.67,23.62 10.67,22.61 10.18,22.12 U1.9
  Top 0.3: C17.1 18.84,26.76 C22.2
  Top 0.381: U1.23 10.05,14.21 10.68,13.58 10.68,11.43 | 19.3,16 RN2.1 | 19.3,16 RN1.1 | v20.32,16.03 20.29,16 19.3,16
  Bottom 0.203: JP7.13 30.35,36.83 | v30.48,36.83 33.4,36.83 | v33.02,36.83 35.69,36.83 | v35.56,36.83 38.23,36.83 | v38.1,36.83 41.02,36.83 | v40.64,36.83 43.05,36.83 | v43.18,36.83 v45.72,36.83 45.85,36.83 | JP6.13 54.23,36.83 | v57.15,36.83 v59.69,36.83 | v62.23,36.83 64.9,36.83 | v64.77,36.83 v67.31,36.83 67.56,36.83 | 23.06,18.39 21.37,18.39 v20.32,17.33 v20.32,16.03
  Bottom 0.254: v5.33,19.05 4.95,19.43 v2.67,19.43 | MS1.4 JP6.13 | MS2.4 JP7.13
  Bottom 0.508: v69.85,36.83 67.56,36.83 64.9,36.83 v59.69,36.83 v54.61,36.83 54.23,36.83 45.85,36.83 43.05,36.83 41.02,36.83 38.23,36.83 35.69,36.83 33.4,36.83 30.35,36.83 MS2.4
  other vias: 2.57,17.2 2.57,18.3 2.57,13.8 2.79,12.19 4.19,12.19 5.46,12.19 6.6,12.19 11.94,28.45 20.57,30.61 22.48,28.57 21.08,28.17 5.23,30.26 5.27,28.01 5.22,29.15 17.65,23.11 17.65,21.59 15.75,21.97 15.75,20.07 16.38,12.83 13.97,4.19 8.76,4.19 12.45,4.19 3.45,23.62 2.41,23.6 5.67,26.58 3.58,25.63 4.67,25.63 4.5,26.59 11.43,16.51 14.35,16.51 11.68,19.3 11.56,13.46 2.46,26.59 3.48,26.58 4.67,24.66 5.33,20.19 7.62,21.21 6.35,21.21 15.75,20.95 14.86,5.71 14.86,6.86 14.86,7.87 17.65,8 21.84,25.15 21.84,24.13 21.84,23.11 10.79,22.35 3.46,24.66 4.66,23.63 10.16,8.76 8.89,7.24 10.67,4.19 8.89,18.16 13.72,19.18 10.03,14.1 6.86,22.61 6.48,9.02 5.46,9.02 4.19,9.02 2.67,9.02 13.21,8.76 3.81,5.84 3.81,4.06 3.81,1.52 5.33,1.52 17.27,6.1 20.42,5.89 18.95,4.22 18.03,3.35 6.86,1.52 7.69,33.66 9.56,33.34 8.94,32.72 15.96,33.55 15.26,32.83 14.19,32.17 12.31,32.05 11.23,32.04 21.58,34.43 20.49,37.97 20.53,36.95 20.48,35.75 20.43,34.44 17.65,20.32 18.58,29.09 18.67,28.07 17.78,26.8 15.24,26.67 14.22,29.46 14.22,28.32 14.22,27.18 12.95,27.69 12.95,26.29 11.94,26.29 11.94,29.97 6.99,30.23 6.99,28.07 6.99,26.54 11.94,27.3 6.22,25.15 11.94,31.11 9.27,23.75 10.67,23.75 15.24,25.53 13.97,25.53 17.78,25.91 21.08,6.73 22.78,37.21 23.54,37.21 23.54,35.68 22.78,36.45 23.54,36.45 23.29,20.68 23.31,19.82 21.23,13.34 22.58,5.66 21.31,18.4 23.13,38 15.11,31.98
  pour Bottom (isolate 0.254, no thermals): 7.32,33.99 24.08,33.99 24.08,4.47 20.32,0.71 1.98,0.71 0.25,2.44 0.25,27.84 4.57,27.84 4.57,30.78 7.32,30.78
  pour Top (isolate 0.3, no thermals): 7.32,33.99 23.52,33.93 24.08,33.38 24.08,4.52 20.22,0.66 2.03,0.66 0.25,2.44 0.25,27.84 4.57,27.84 4.57,30.78 7.32,30.78
  pour Top (isolate 0.3, no thermals): 20.07,38.62 23.86,38.62 23.86,37.6 26.44,37.6 26.44,35.53 24.05,35.53 24.05,35.54 23.81,35.54 23.81,33.07 19.93,33.07 19.93,38.59 19.95,38.61 20.08,38.61
  pour Bottom (no thermals): 19.95,38.63 24.11,38.63 24.11,37.61 26.44,37.61 26.44,35.53 24.07,35.53 24.07,33.05 19.94,33.05 19.94,38.64
LINKLED
  Top 0.254: U1.25 8.64,11.96 8.64,11.43 7.24,10.03 R22.2
MISO  (via drill 0.35)
  Top 0.203: U1.34 13.28,11.91 13.28,11.11 14.1,10.29 16.76,10.29 17.27,9.78
  Top 0.508: v17.4,9.78 17.27,9.78
  Bottom 0.203: 21.97,13.97 MS2.13 20.95,13.97 18.29,11.3 18.29,10.54 17.53,9.78 v17.4,9.78
  Bottom 0.254: JP6.4 MS1.13 48.26,13.97 46.99,12.7 29.21,12.7 JP7.4 MS2.13
MOSI  (via drill 0.35)
  Top 0.203: U1.35 13.68,11.21 14.1,10.79 v17.4,10.79
  Bottom 0.203: v17.4,10.79 17.4,11.05 22.86,16.51 MS2.12
  Bottom 0.254: JP6.5 MS1.12 48.26,16.51 46.99,15.24 29.21,15.24 JP7.5 MS2.12
N$1
  Top 0.152: 15.94,16.76 U1.43 16,16.83 17.26,16.83 17.96,17.53 RN2.7
N$2
  Top 0.152: 15.94,17.27 U1.44 16.95,17.21 17.78,18.03 RN2.6
N$3
  Top 0.152: U1.45 16.69,17.71 17.53,18.54 18.26,18.54 RN2.5
N$4  (via drill 1.1 pad 1.93)
  other vias: 30.48,6.35
N$5
  Top 0.152: U1.38 15.89,14.22 17.53,14.22 17.74,14.44 RN1.8
N$6
  Top 0.152: U1.39 15.9,14.73 17.53,14.73 17.78,14.99 RN1.7
N$7
  Top 0.152: U1.40 15.91,15.24 17.53,15.24 17.78,15.49 RN1.6
N$8
  Top 0.152: U1.41 15.92,15.75 17.53,15.75 17.82,16.04 RN1.5
N$9
  Top 0.152: U1.42 15.93,16.26 17.53,16.26 18.25,16.98 RN2.8
N$10  (via drill 1.1 pad 1.93)
  other vias: 33.02,6.35
N$11
  Top 0.152: 12.62,6.91 Y1.1
  Top 0.254: C8.2 13.44,6.33 Y1.1 11.89,7.87 R17.1
N$12
  Top 0.254: U1.20 5.08,15.71 C16.1
N$13
  cutout Top: 15.75,27.43 17.4,27.43 17.4,25.27 16.89,24.77 15.75,24.77 15.62,24.89 15.62,27.43
N$14
  cutout Top: 19.3,33.91 17.4,32 17.4,31.37 17.27,31.24 15.62,31.24 15.49,31.37 15.49,32.38 17.27,34.16 18.92,34.16 18.92,33.66
N$15
  Top 0.254: U1.22 5.95,14.71 5.33,14.1 5.33,13.46 5.03,13.16 C26.2
N$16
  Bottom 0.254: JP6.14 MS1.3 48.26,39.37 46.99,38.1 29.21,38.1 JP7.14 MS2.3
N$17
  Top 0.254: U1.10 9.68,22.74 R6.2
N$18
  Bottom 0.254: JP8.2 MS2.27 46.99,31.75 48.26,33.02 66.04,33.02 JP9.2 MS1.27
N$19  (via drill 0.35)
  Top 0.3: RJ45.R3 13.06,34.7 9.96,34.7 9.28,34.02 | 8.26,32.99 9.28,34.02 | 9.28,34.02 7.98,32.72 C14.2 7.98,28.25 R13.1 7.9,27.41 7.87,27.41 v7.85,27.38 | R14.1 10.88,28.18 v10.88,27.38
  Bottom 0.3: v7.85,27.38 v10.88,27.38 | v10.88,27.38 10.97,27.38 v10.88,27.38
N$20
  Top 0.152: 19.07,22.67 D1.C
  Top 0.254: D1.C 19.79,21.7 R24.2
N$21  (via drill 0.35)
  Top 0.3: R12.1 12.98,31.04 12.95,31.06
  Top 0.559: v13.34,31.45 12.95,31.06 C11.2
  Bottom 0.3: RJ45.R4 v13.34,31.45
N$22
  Top 0.254: 11.68,10.21 R8.1 11.91,9.4 | U1.31 11.68,10.21 | 11.68,10.21 11.68,9.63 11.91,9.4 | R17.2 11.99,9.32 11.91,9.4
N$23
  Bottom 0.254: JP8.10 MS2.19 46.99,11.43 48.26,12.7 66.04,12.7 JP9.10 MS1.19
N$24  (via drill 0.35)
  Top 0.254: JP8.9 41.91,12.7 25.02,12.7 24.64,12.32 v23.37,12.32
  Bottom 0.254: JP8.9 MS2.20 46.99,13.97 48.26,15.24 66.04,15.24 JP9.9 MS1.20 | 23.11,11.71 23.11,12.06 v23.37,12.32 | 23.11,11.71 23.28,11.71 | JP3.1 23.11,11.71
N$25  (via drill 0.35)
  Top 0.203: JP8.8 41.91,15.24 24.89,15.24 24.13,14.48 v24.13,13.34
  Bottom 0.152: v24.13,13.34 24.13,10.03 23.75,9.65 JP2.1 | 23.11,10.01 23.26,10.01
  Bottom 0.254: JP8.8 MS2.21 46.99,16.51 48.26,17.78 66.04,17.78 JP9.8 MS1.21
  Bottom 0.508: JP2.1 23.11,10.01
N$26  (via drill 0.35)
  Top 0.203: 42.99,18.86 JP8.7 | 23.37,16.26 24.89,17.78
  Top 0.254: v22.35,6.6 22.35,12.32 23.11,13.08 23.11,16 24.89,17.78 24.92,17.8 41.94,17.8 42.99,18.86
  Bottom 0.254: JP8.7 MS2.22 46.99,19.05 48.26,20.32 66.04,20.32 JP9.7 MS1.22 | JP1.1 23.11,6.99 22.73,6.6 v22.35,6.6
N$27
  Bottom 0.254: JP8.6 MS2.23 46.99,21.59 48.26,22.86 66.04,22.86 JP9.6 MS1.23
N$28
  Bottom 0.254: JP8.5 MS2.24 46.99,24.13 48.26,25.4 66.04,25.4 JP9.5 MS1.24
N$29
  Top 0.152: Y1.3 10.18,5.36 9.81,5.1
  Top 0.254: C7.2 10.06,5.36 10.18,5.36 | U1.30 11.18,10.29 | Y1.3 11.18,6.45 11.18,6.46 11.18,10.21 | 11.18,10.28 11.18,10.29 | R8.2 11.18,10.21 | 11.18,10.21 11.18,10.29
N$30
  Bottom 0.254: JP8.4 MS2.25 46.99,26.67 48.26,27.94 66.04,27.94 JP9.4 MS1.25
N$31
  Bottom 0.254: JP6.12 MS1.5 48.26,34.29 46.99,33.02 29.21,33.02 JP7.12 MS2.5
N$32
  Bottom 0.254: JP6.11 MS1.6 48.26,31.75 46.99,30.48 29.21,30.48 JP7.11 MS2.6
N$33
  Bottom 0.254: JP6.10 MS1.7 48.26,29.21 46.99,27.94 29.21,27.94 JP7.10 MS2.7
N$34
  Bottom 0.254: JP6.9 MS1.8 48.26,26.67 46.99,25.4 29.21,25.4 JP7.9 MS2.8
N$35
  Bottom 0.254: JP6.8 MS1.9 48.26,24.13 46.99,22.86 29.21,22.86 JP7.8 MS2.9
N$36
  Bottom 0.254: JP6.7 MS1.10 48.26,21.59 46.99,20.32 29.21,20.32 JP7.7 MS2.10
N$37  (via drill 0.35)
  Top 0.254: v2.08,11.07 2.11,11.05 R23.1
  Bottom 0.254: RJ45.12 13.8,47.88 4.5,47.88 1.63,45.01 1.63,11.53 v2.08,11.07
N$38  (via drill 1.1 pad 1.93)
  other vias: 35.56,6.35
N$39
  Bottom 0.254: JP6.3 MS1.14 48.26,11.43 46.99,10.16 29.21,10.16 JP7.3 MS2.14
N$40  (via drill 1.1 pad 1.93)
  other vias: 38.1,6.35
N$41
  Bottom 0.254: JP8.11 MS2.18 46.99,8.89 48.26,10.16 66.04,10.16 JP9.11 MS1.18
N$42
  Bottom 0.254: JP8.12 MS2.17 46.99,6.35 48.26,7.62 66.04,7.62 JP9.12 MS1.17
N$43
  Bottom 0.254: JP6.2 MS1.15 48.26,8.89 46.99,7.62 29.21,7.62 JP7.2 MS2.15
N$44
  Bottom 0.254: JP6.1 MS1.16 48.26,6.35 47.02,5.11 46.97,5.11 | MS2.16 JP7.1 28.72,6.35 29.96,5.11 46.97,5.11 | 46.99,5.08 46.97,5.11
N$45  (via drill 1.1 pad 1.93)
  other vias: 40.64,6.35
N$46  (via drill 1.1 pad 1.93)
  other vias: 40.64,8.89
N$47  (via drill 1.1 pad 1.93)
  other vias: 38.1,8.89
N$48  (via drill 1.1 pad 1.93)
  other vias: 35.56,8.89
N$49  (via drill 1.1 pad 1.93)
  other vias: 33.02,8.89
N$50  (via drill 1.1 pad 1.93)
  other vias: 54.61,6.35
N$51  (via drill 1.1 pad 1.93)
  other vias: 57.15,6.35
N$52  (via drill 1.1 pad 1.93)
  other vias: 59.69,6.35
N$53  (via drill 1.1 pad 1.93)
  other vias: 30.48,8.89
N$54  (via drill 1.1 pad 1.93)
  other vias: 62.23,6.35
N$55
  cutout Top: 23.75,12.19 24.26,12.19 24.38,12.06 24.38,5.59 24,5.21 22.94,5.21 22.94,6.22 23.62,6.22 23.75,6.35
N$56
  cutout Top: 19.05,25.4 20.19,25.4 20.19,22.48 19.43,22.48 19.05,22.86
N$58  (via drill 1.1 pad 1.93)
  other vias: 64.77,6.35
N$59  (via drill 1.1 pad 1.93)
  other vias: 64.77,8.89
N$62  (via drill 1.1 pad 1.93)
  other vias: 62.23,8.89
N$63  (via drill 1.1 pad 1.93)
  other vias: 59.69,8.89
N$64  (via drill 1.1 pad 1.93)
  other vias: 57.15,8.89
N$65  (via drill 1.1 pad 1.93)
  other vias: 54.61,8.89
N$66  (via drill 1.1 pad 1.93)
  other vias: 54.61,3.81
N$67  (via drill 1.1 pad 1.93)
  other vias: 57.15,3.81
N$68  (via drill 1.1 pad 1.93)
  other vias: 59.69,3.81
N$69  (via drill 1.1 pad 1.93)
  other vias: 62.23,3.81
N$70  (via drill 1.1 pad 1.93)
  other vias: 64.77,3.81
N$71  (via drill 1.1 pad 1.93)
  other vias: 64.77,1.27
N$72  (via drill 1.1 pad 1.93)
  other vias: 62.23,1.27
N$73  (via drill 1.1 pad 1.93)
  other vias: 59.69,1.27
N$74  (via drill 1.1 pad 1.93)
  other vias: 57.15,1.27
N$75  (via drill 1.1 pad 1.93)
  other vias: 54.61,1.27
N$76  (via drill 1.1 pad 1.93)
  other vias: 54.61,11.43
N$77  (via drill 1.1 pad 1.93)
  other vias: 57.15,11.43
N$78  (via drill 1.1 pad 1.93)
  other vias: 59.69,11.43
N$79  (via drill 1.1 pad 1.93)
  other vias: 62.23,11.43
N$80
  cutout Top: 17.27,24.13 14.73,21.59 13.46,21.59 13.46,22.61 15.75,24.89
N$82
  cutout Top: 8.38,29.97 10.41,29.97 10.41,25.15 8.38,25.15
N$83
  cutout Top: 15.24,31.11 17.83,31.11 17.83,27.43 15.24,27.43
N$84
  cutout Top: 7.49,31.17 10.67,31.17 10.67,28.07 7.49,28.07
N$87  (via drill 0.35)
  Top 0.254: v2.03,10.01 3.3,10.01 R22.1
  Bottom 0.254: RJ45.14 1.14,45.34 1.14,10.85 1.98,10.01 v2.03,10.01
N$139  (via drill 1.1 pad 1.93)
  other vias: 30.48,11.43
N$140  (via drill 1.1 pad 1.93)
  other vias: 33.02,11.43
N$141  (via drill 1.1 pad 1.93)
  other vias: 35.56,11.43
N$142  (via drill 1.1 pad 1.93)
  other vias: 38.1,11.43
N$143  (via drill 1.1 pad 1.93)
  other vias: 40.64,11.43
N$144  (via drill 1.1 pad 1.93)
  other vias: 40.64,13.97
N$145  (via drill 1.1 pad 1.93)
  other vias: 38.1,13.97
N$146  (via drill 1.1 pad 1.93)
  other vias: 35.56,13.97
N$147  (via drill 1.1 pad 1.93)
  other vias: 33.02,13.97
N$148  (via drill 1.1 pad 1.93)
  other vias: 30.48,13.97
N$149  (via drill 1.1 pad 1.93)
  other vias: 30.48,16.51
N$150  (via drill 1.1 pad 1.93)
  other vias: 33.02,16.51
N$151  (via drill 1.1 pad 1.93)
  other vias: 35.56,16.51
N$152  (via drill 1.1 pad 1.93)
  other vias: 38.1,16.51
N$153  (via drill 1.1 pad 1.93)
  other vias: 40.64,16.51
N$154  (via drill 1.1 pad 1.93)
  other vias: 40.64,19.05
N$155  (via drill 1.1 pad 1.93)
  other vias: 38.1,19.05
N$156  (via drill 1.1 pad 1.93)
  other vias: 35.56,19.05
N$157  (via drill 1.1 pad 1.93)
  other vias: 33.02,19.05
N$158  (via drill 1.1 pad 1.93)
  other vias: 30.48,19.05
N$159  (via drill 1.1 pad 1.93)
  other vias: 30.48,21.59
N$160  (via drill 1.1 pad 1.93)
  other vias: 33.02,21.59
N$161  (via drill 1.1 pad 1.93)
  other vias: 35.56,21.59
N$162  (via drill 1.1 pad 1.93)
  other vias: 38.1,21.59
N$163  (via drill 1.1 pad 1.93)
  other vias: 40.64,21.59
N$164  (via drill 1.1 pad 1.93)
  other vias: 40.64,24.13
N$165  (via drill 1.1 pad 1.93)
  other vias: 38.1,24.13
N$166  (via drill 1.1 pad 1.93)
  other vias: 35.56,24.13
N$167  (via drill 1.1 pad 1.93)
  other vias: 33.02,24.13
N$168  (via drill 1.1 pad 1.93)
  other vias: 30.48,24.13
N$169  (via drill 1.1 pad 1.93)
  other vias: 30.48,26.67
N$170  (via drill 1.1 pad 1.93)
  other vias: 33.02,26.67
N$171  (via drill 1.1 pad 1.93)
  other vias: 35.56,26.67
N$172  (via drill 1.1 pad 1.93)
  other vias: 38.1,26.67
N$173  (via drill 1.1 pad 1.93)
  other vias: 40.64,26.67
N$174  (via drill 1.1 pad 1.93)
  other vias: 40.64,29.21
N$175  (via drill 1.1 pad 1.93)
  other vias: 38.1,29.21
N$176  (via drill 1.1 pad 1.93)
  other vias: 35.56,29.21
N$177  (via drill 1.1 pad 1.93)
  other vias: 33.02,29.21
N$178  (via drill 1.1 pad 1.93)
  other vias: 30.48,29.21
N$179  (via drill 1.1 pad 1.93)
  other vias: 30.48,31.75
N$180  (via drill 1.1 pad 1.93)
  other vias: 33.02,31.75
N$181  (via drill 1.1 pad 1.93)
  other vias: 35.56,31.75
N$182  (via drill 1.1 pad 1.93)
  other vias: 38.1,31.75
N$183  (via drill 1.1 pad 1.93)
  other vias: 40.64,31.75
N$184  (via drill 1.1 pad 1.93)
  other vias: 40.64,34.29
N$185  (via drill 1.1 pad 1.93)
  other vias: 38.1,34.29
N$186  (via drill 1.1 pad 1.93)
  other vias: 35.56,34.29
N$187  (via drill 1.1 pad 1.93)
  other vias: 33.02,34.29
N$188  (via drill 1.1 pad 1.93)
  other vias: 30.48,34.29
N$189  (via drill 1.1 pad 1.93)
  other vias: 30.48,39.37
N$190  (via drill 1.1 pad 1.93)
  other vias: 33.02,39.37
N$191  (via drill 1.1 pad 1.93)
  other vias: 35.56,39.37
N$192  (via drill 1.1 pad 1.93)
  other vias: 38.1,39.37
N$193  (via drill 1.1 pad 1.93)
  other vias: 40.64,39.37
N$194  (via drill 1.1 pad 1.93)
  other vias: 43.18,39.37
N$195  (via drill 1.1 pad 1.93)
  other vias: 45.72,39.37
N$196  (via drill 1.1 pad 1.93)
  other vias: 30.48,44.45
N$197  (via drill 1.1 pad 1.93)
  other vias: 33.02,44.45
N$198  (via drill 1.1 pad 1.93)
  other vias: 35.56,44.45
N$199  (via drill 1.1 pad 1.93)
  other vias: 38.1,44.45
N$200  (via drill 1.1 pad 1.93)
  other vias: 40.64,44.45
N$201  (via drill 1.1 pad 1.93)
  other vias: 43.18,44.45
N$202  (via drill 1.1 pad 1.93)
  other vias: 45.72,44.45
N$203  (via drill 1.1 pad 1.93)
  other vias: 40.64,46.99
N$204  (via drill 1.1 pad 1.93)
  other vias: 40.64,49.53
N$205  (via drill 1.1 pad 1.93)
  other vias: 38.1,49.53
N$206  (via drill 1.1 pad 1.93)
  other vias: 38.1,46.99
N$207  (via drill 1.1 pad 1.93)
  other vias: 35.56,46.99
N$208  (via drill 1.1 pad 1.93)
  other vias: 35.56,49.53
N$209  (via drill 1.1 pad 1.93)
  other vias: 33.02,49.53
N$210  (via drill 1.1 pad 1.93)
  other vias: 33.02,46.99
N$211  (via drill 1.1 pad 1.93)
  other vias: 30.48,46.99
N$212  (via drill 1.1 pad 1.93)
  other vias: 30.48,49.53
N$213  (via drill 1.1 pad 1.93)
  other vias: 64.77,11.43
N$214  (via drill 1.1 pad 1.93)
  other vias: 64.77,13.97
N$215  (via drill 1.1 pad 1.93)
  other vias: 62.23,13.97
N$216  (via drill 1.1 pad 1.93)
  other vias: 59.69,13.97
N$217  (via drill 1.1 pad 1.93)
  other vias: 57.15,13.97
N$218  (via drill 1.1 pad 1.93)
  other vias: 54.61,13.97
N$219  (via drill 1.1 pad 1.93)
  other vias: 54.61,16.51
N$220  (via drill 1.1 pad 1.93)
  other vias: 57.15,16.51
N$221  (via drill 1.1 pad 1.93)
  other vias: 59.69,16.51
N$222  (via drill 1.1 pad 1.93)
  other vias: 62.23,16.51
N$223  (via drill 1.1 pad 1.93)
  other vias: 64.77,16.51
N$224  (via drill 1.1 pad 1.93)
  other vias: 64.77,19.05
N$225  (via drill 1.1 pad 1.93)
  other vias: 62.23,19.05
N$226  (via drill 1.1 pad 1.93)
  other vias: 59.69,19.05
N$227  (via drill 1.1 pad 1.93)
  other vias: 57.15,19.05
N$228  (via drill 1.1 pad 1.93)
  other vias: 54.61,19.05
N$229  (via drill 1.1 pad 1.93)
  other vias: 54.61,21.59
N$230  (via drill 1.1 pad 1.93)
  other vias: 57.15,21.59
N$231  (via drill 1.1 pad 1.93)
  other vias: 59.69,21.59
N$232  (via drill 1.1 pad 1.93)
  other vias: 62.23,21.59
N$233  (via drill 1.1 pad 1.93)
  other vias: 64.77,21.59
N$234  (via drill 1.1 pad 1.93)
  other vias: 64.77,24.13
N$235  (via drill 1.1 pad 1.93)
  other vias: 62.23,24.13
N$236  (via drill 1.1 pad 1.93)
  other vias: 59.69,24.13
N$237  (via drill 1.1 pad 1.93)
  other vias: 57.15,24.13
N$238  (via drill 1.1 pad 1.93)
  other vias: 54.61,24.13
N$239  (via drill 1.1 pad 1.93)
  other vias: 54.61,26.67
N$240  (via drill 1.1 pad 1.93)
  other vias: 57.15,26.67
N$241  (via drill 1.1 pad 1.93)
  other vias: 59.69,26.67
N$242  (via drill 1.1 pad 1.93)
  other vias: 62.23,26.67
N$243  (via drill 1.1 pad 1.93)
  other vias: 64.77,26.67
N$244  (via drill 1.1 pad 1.93)
  other vias: 64.77,29.21
N$245  (via drill 1.1 pad 1.93)
  other vias: 62.23,29.21
N$246  (via drill 1.1 pad 1.93)
  other vias: 59.69,29.21
N$247  (via drill 1.1 pad 1.93)
  other vias: 57.15,29.21
N$248  (via drill 1.1 pad 1.93)
  other vias: 54.61,29.21
N$249  (via drill 1.1 pad 1.93)
  other vias: 54.61,31.75
N$250  (via drill 1.1 pad 1.93)
  other vias: 57.15,31.75
N$251  (via drill 1.1 pad 1.93)
  other vias: 59.69,31.75
N$252  (via drill 1.1 pad 1.93)
  other vias: 62.23,31.75
N$253  (via drill 1.1 pad 1.93)
  other vias: 64.77,31.75
N$254  (via drill 1.1 pad 1.93)
  other vias: 64.77,34.29
N$255  (via drill 1.1 pad 1.93)
  other vias: 62.23,34.29
N$256  (via drill 1.1 pad 1.93)
  other vias: 59.69,34.29
N$257  (via drill 1.1 pad 1.93)
  other vias: 57.15,34.29
N$258  (via drill 1.1 pad 1.93)
  other vias: 54.61,34.29
N$259  (via drill 1.1 pad 1.93)
  other vias: 54.61,39.37
N$260  (via drill 1.1 pad 1.93)
  other vias: 57.15,39.37
N$261  (via drill 1.1 pad 1.93)
  other vias: 59.69,39.37
N$262  (via drill 1.1 pad 1.93)
  other vias: 62.23,39.37
N$263  (via drill 1.1 pad 1.93)
  other vias: 64.77,39.37
N$264  (via drill 1.1 pad 1.93)
  other vias: 67.31,39.37
N$265  (via drill 1.1 pad 1.93)
  other vias: 69.85,39.37
N$266  (via drill 1.1 pad 1.93)
  other vias: 54.61,44.45
N$267  (via drill 1.1 pad 1.93)
  other vias: 57.15,44.45
N$268  (via drill 1.1 pad 1.93)
  other vias: 59.69,44.45
N$269  (via drill 1.1 pad 1.93)
  other vias: 62.23,44.45
N$270  (via drill 1.1 pad 1.93)
  other vias: 64.77,44.45
N$271  (via drill 1.1 pad 1.93)
  other vias: 67.31,44.45
N$272  (via drill 1.1 pad 1.93)
  other vias: 69.85,44.45
N$273  (via drill 1.1 pad 1.93)
  other vias: 64.77,46.99
N$274  (via drill 1.1 pad 1.93)
  other vias: 64.77,49.53
N$275  (via drill 1.1 pad 1.93)
  other vias: 62.23,49.53
N$276  (via drill 1.1 pad 1.93)
  other vias: 62.23,46.99
N$277  (via drill 1.1 pad 1.93)
  other vias: 59.69,46.99
N$278  (via drill 1.1 pad 1.93)
  other vias: 59.69,49.53
N$279  (via drill 1.1 pad 1.93)
  other vias: 57.15,49.53
N$280  (via drill 1.1 pad 1.93)
  other vias: 57.15,46.99
N$281  (via drill 1.1 pad 1.93)
  other vias: 54.61,46.99
N$282  (via drill 1.1 pad 1.93)
  other vias: 54.61,49.53
R_N
  Top 0.3: R37.2 9.62,26.01 9.62,25.62 9.87,25.37 10.81,25.37 11.95,24.24 12,24.19 12.18,24 U1.5
R_P
  Top 0.3: R36.2 9.17,26.06 9.17,25.43 9.69,24.92 10.62,24.92 11.68,23.86 11.68,21.93 | U1.6 11.68,21.93 | 11.68,21.93 11.68,21.94
RR_N
  Top 0.3: RJ45.R1 17.48,36.57 17.48,37.24 17.33,37.38 16.87,37.38 16.18,36.69 16.18,35.12 14.11,33.05 11.02,33.05 9.62,31.66 9.62,30.99 9.91,30.71 C13.2
RR_P
  Top 0.3: RJ45.R2 16.55,38.1 16.55,37.7 15.72,36.87 15.72,35.31 13.92,33.5 10.83,33.5 9.17,31.84 9.17,30.99 8.89,30.71 C12.2
RX_N
  Top 0.3: R14.2 9.93,27.3 R37.1
  Top 0.5: R37.1 C13.1
RX_P
  Top 0.3: R13.2 8.87,27.3 R36.1
  Top 0.5: R36.1 C12.1
SCLK  (via drill 0.35)
  Top 0.203: U1.33 12.68,11.2 14.1,9.78 15.75,9.78 16,9.53 v16.38,9.53
  Bottom 0.203: MS2.11 24.64,19.05 16.38,10.79 v16.38,9.53
  Bottom 0.254: JP6.6 MS1.11 48.26,19.05 46.99,17.78 29.21,17.78 JP7.6 MS2.11
SCSN  (via drill 0.35)
  Top 0.152: 19.07,8.61 19.07,8.76 R21.1
  Top 0.203: U1.32 12.18,11.19 14.1,9.27 15.37,9.27 15.88,8.76 19.07,8.76 | R21.1 18.92,8.69 v18.92,8
  Bottom 0.203: JP1.2 22.3,7.95 22.25,8 v18.92,8
T_N
  Top 0.3: R35.2 16.74,28.32 16.74,24.49 14.14,21.9 14.14,20.94 U1.1
T_P
  Top 0.152: R34.2 16.15,28.6
  Top 0.3: R34.2 16.28,28.32 16.28,24.68 13.69,22.09 13.69,20.92 U1.2
TX_N
  Top 0.3: RJ45.R5 12.06,36.73 11.63,37.16 9.86,37.16 9.81,37.22 | 9.81,37.22 9.27,37.75 9.27,40.38 10.32,41.42 16.91,41.42 18.88,39.45 18.88,34.56 16.74,32.42 16.74,31.37 17.04,31.06 R10.1 17.02,30.45 R35.1 | 9.81,37.22
TX_P
  Top 0.3: RJ45.R6 11.31,38.78 11.84,38.25 11.84,37.82 11.63,37.62 10.05,37.62 9.73,37.94 9.73,40.19 10.51,40.97 16.72,40.97 18.38,39.31 18.38,34.7 16.28,32.61 16.28,31.37 15.98,31.06 R11.1 16,30.45 R34.1
V+
  Top 0.762: RJ45.R9 5.97,35.22 J3.2
V-
  Top 0.762: RJ45.R10 4.22,37.28 4.22,34.04 4.22,33.53 4.22,32.92 J3.1
VBAT
  Bottom 0.254: JP8.1 MS2.28 46.99,34.29 48.26,35.56 66.04,35.56 JP9.1 MS1.28
VPOE
  Top 0.762: JP8.3 46.69,29.21 47.6,28.3 47.6,5.18 47.14,4.72 21.46,4.72 18.52,1.78 J1.1
  Bottom 0.254: JP8.3 MS2.26 46.99,29.21 48.26,30.48 66.04,30.48 JP9.3 MS1.26

### Text on the board
bPlace: v1.0